# EAGLE design HF_Receiver (EAGLE 7.6.0)
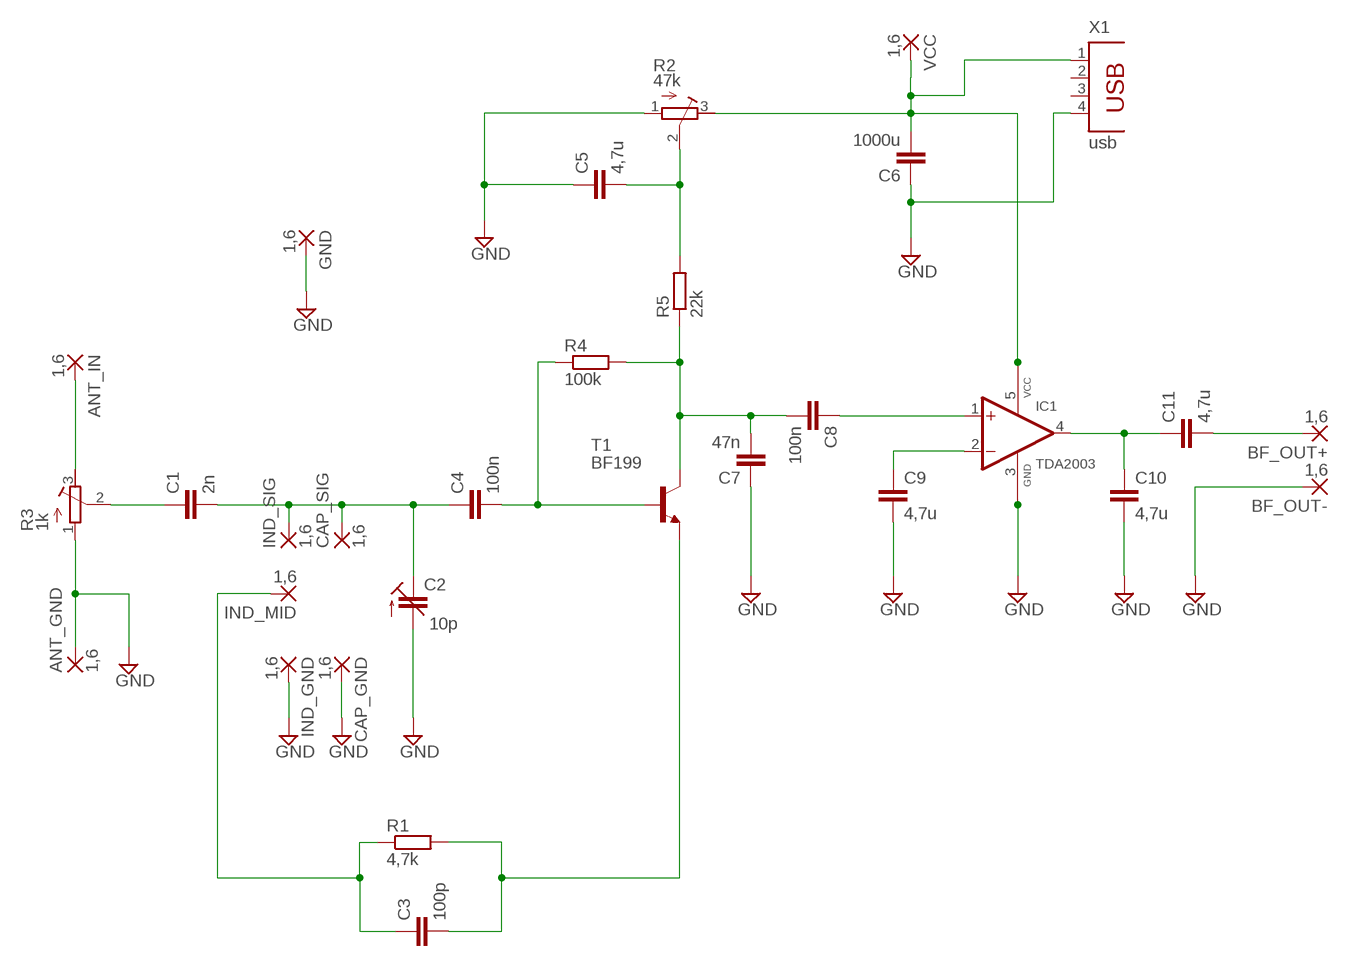
[diagram p0: schematic, sheet 1]

## Parts
ANT_GND  1,6  1,6/0,9  [1,6/0,9]
ANT_IN  1,6  1,6/0,9  [1,6/0,9]
BF_OUT+  1,6  1,6/0,9  [1,6/0,9]
BF_OUT-  1,6  1,6/0,9  [1,6/0,9]
C1  2n  C-EU075-032X103  [C075-032X103]
C2  10p  C-TRIMM808  [CTRIM808-BC]
C3  100p  C-EU075-032X103  [C075-032X103]
C4  100n  C-EU075-032X103  [C075-032X103]
C5  4,7u  C-EU075-032X103  [C075-032X103]
C6  1000u  C-EU075-032X103  [C075-032X103]
C7  47n  C-EU075-032X103  [C075-032X103]
C8  100n  C-EU075-032X103  [C075-032X103]
C9  4,7u  C-EU075-032X103  [C075-032X103]
C10  4,7u  C-EU075-032X103  [C075-032X103]
C11  4,7u  C-EU075-032X103  [C075-032X103]
CAP_GND  1,6  1,6/0,9  [1,6/0,9]
CAP_SIG  1,6  1,6/0,9  [1,6/0,9]
GND  1,6  1,6/0,9  [1,6/0,9]
IC1  TDA2003  [PENTAWATT-V]
IND_GND  1,6  1,6/0,9  [1,6/0,9]
IND_MID  1,6  1,6/0,9  [1,6/0,9]
IND_SIG  1,6  1,6/0,9  [1,6/0,9]
R1  4,7k  R-EU_0207/10  [0207/10]
R2  47k  R-TRIMM3339P  [RTRIM3339P]
R3  1k  R-TRIMM3339P  [RTRIM3339P]
R4  100k  R-EU_0207/10  [0207/10]
R5  22k  R-EU_0207/10  [0207/10]
T1  BF199  [TO92]
VCC  1,6  1,6/0,9  [1,6/0,9]
X1  usb  PN87520  [PN87520]

## Nets
GND: ANT_GND.1(P) BF_OUT-.1(P) C2.2(A) C5.1 C6.1 C7.1 C9.2 C10.2 CAP_GND.1(P) GND.1(P) IC1.3(GND) IND_GND.1(P) R2.1(A) R3.1(A) X1.4
N$1: ANT_IN.1(P) R3.3(E)
N$3: C1.1 R3.2(S)
N$4: C1.2 C2.1(E) C4.1 CAP_SIG.1(P) IND_SIG.1(P)
N$5: C3.1 IND_MID.1(P) R1.1
N$6: C3.2 R1.2 T1.2(E)
N$7: C4.2 R4.1 T1.1(B)
N$8: C8.1 IC1.1(+IN)
N$9: C7.2 C8.2 R4.2 R5.1 T1.3(C)
N$11: C5.2 R2.2(S) R5.2
N$12: C9.1 IC1.2(-IN)
N$13: C10.1 C11.1 IC1.4(OUT)
N$14: BF_OUT+.1(P) C11.2
VCC: C6.2 IC1.5(VCC) R2.3(E) VCC.1(P) X1.1
Unconnected: X1.2 X1.3

## Library data of the parts
ANT_GND ANT_IN BF_OUT+ BF_OUT- CAP_GND CAP_SIG GND IND_GND IND_MID IND_SIG VCC = wirepad:1,6/0,9: THROUGH-HOLE PAD
C1 C3-C11 = resistor:C-EU: CAPACITOR, European symbol
C2 = rcl:C-TRIMM: Trimm capacitor
IC1 = tda2003:TDA2003: Car Radio Audio Amplifier
R1 R4 R5 = resistor:R-EU_: RESISTOR, European symbol
R2 R3 = resistor:R-TRIMM: Trimm resistor
T1 = transistor:BF199: NPN TRANSISTOR
X1 = con-berg:PN87520: BERG USB connector; OC_FARNELL: unknown; OC_NEWARK: unknown

## Board
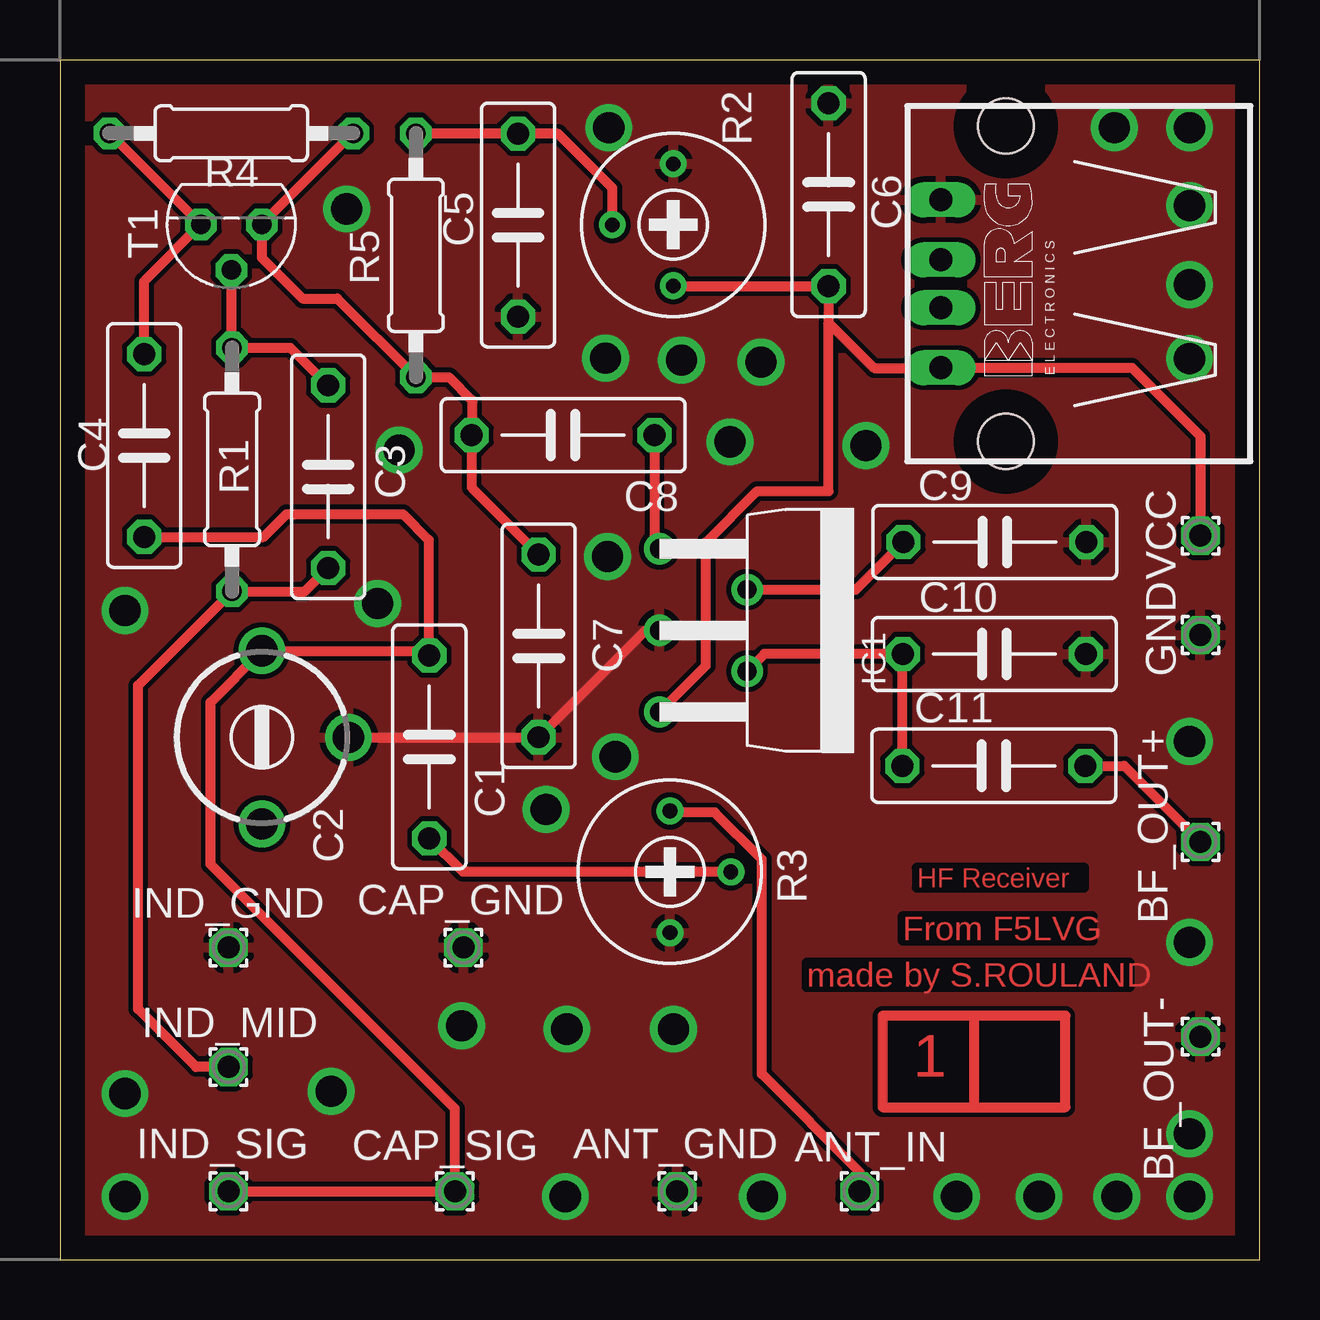
[diagram p1: board, top side]
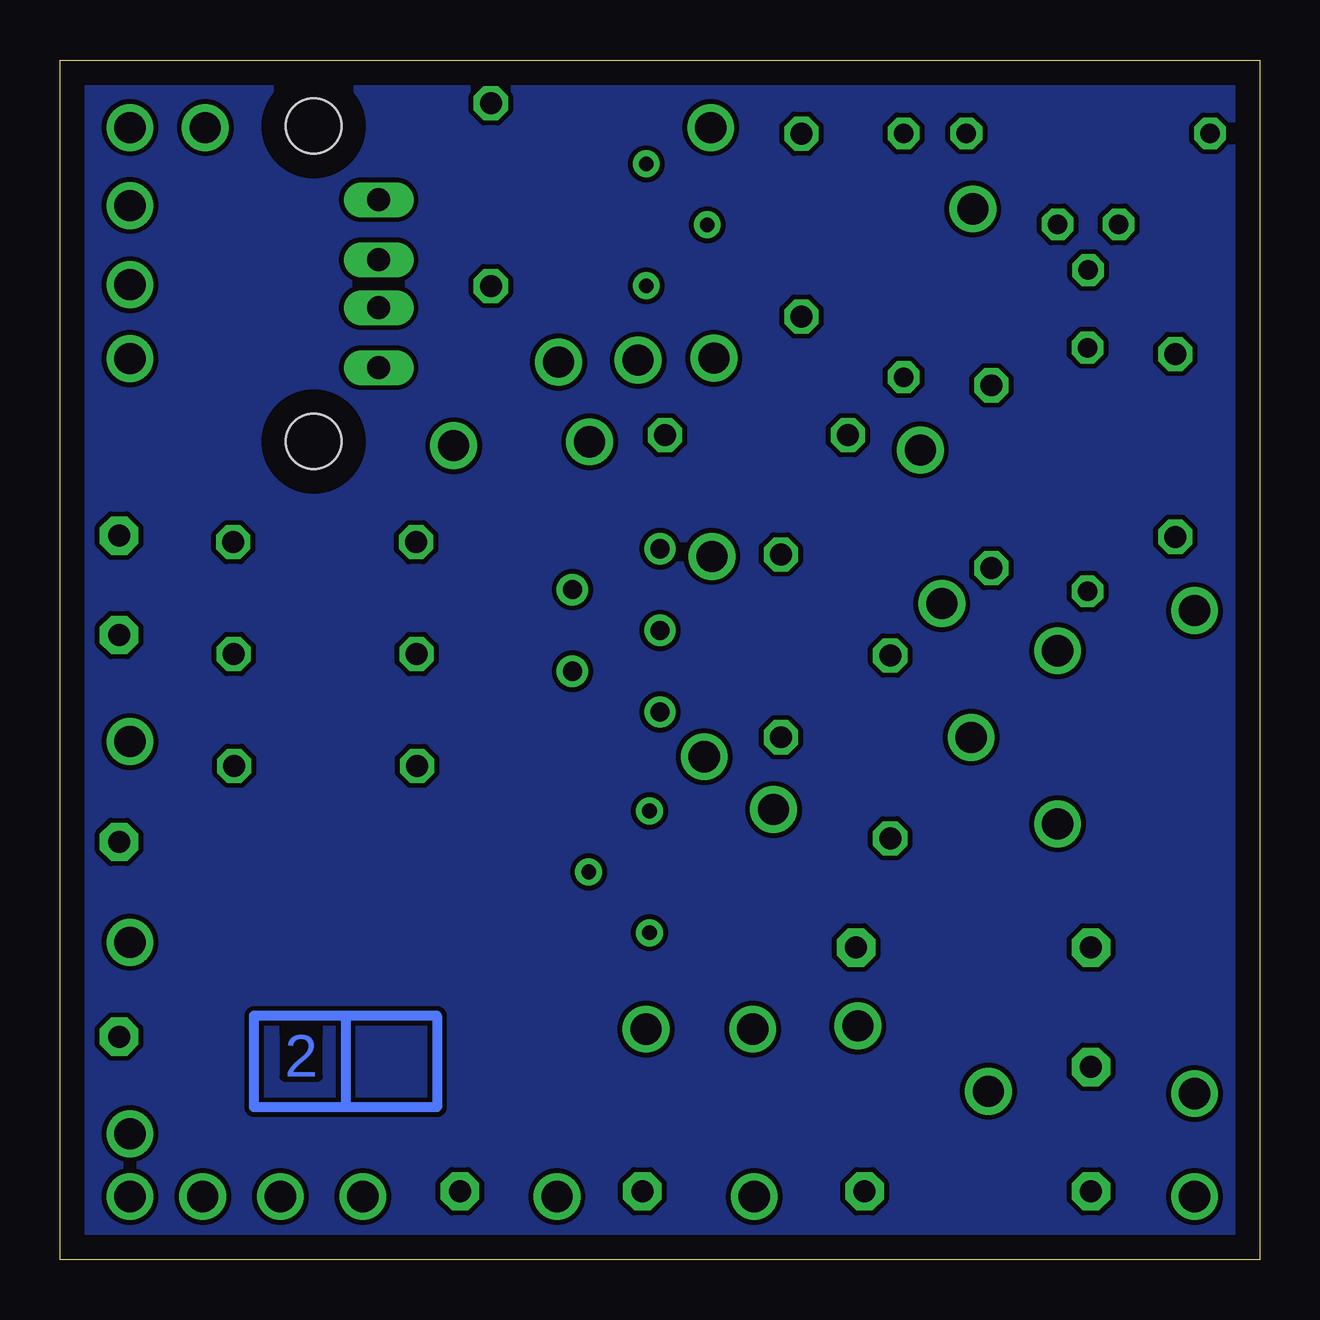
[diagram p2: board, bottom side, seen from below]

Size 50 x 50 mm. Coordinates in mm from the lower left corner, seen from the top.
Outline: 0,0 50,0 50,50 0,50 0,0
Copper layers (1*16): Top 0.035mm / dielectric 1.5mm / Bottom 0.035mm
Design rules "default *": minimum track width 10mil, minimum drill 24mil, track to track 8mil, track to pad 8mil, pad to pad 8mil, via to via 8mil, smd to smd 8mil, copper to edge 40mil, drill to drill 8mil, minimum pad ring 10mil, minimum via ring 8mil, stop-mask expansion 4mil, vias tented up to drill 0mil, thermal gap 10mil

### Footprints (pad centres in the part's own frame; a part is rotated, then mirrored left to right if it is on the bottom)
1,6/0,9 = drill 0.914 pad 1.6 octagon: 1 0,0
C075-032X103 = drill 0.914 octagon: 1 -3.81,0; 2 3.81,0
CTRIM808-BC = drill 1.3: 1 -3.607,0; 2 0,3.607; 3 3.607,0
PENTAWATT-V = drill 0.8: 1 -3.4,-3.81; 2 -1.7,-0.16; 3 0,-3.81; 4 1.7,-0.16; 5 3.4,-3.81
0207/10 = drill 0.813 octagon: 1 -5.08,0; 2 5.08,0
RTRIM3339P = drill 0.61: 1 -2.54,0; 2 0,-2.54; 3 2.54,0
TO92 = drill 0.813 octagon: 1 1.27,0; 2 0,1.905; 3 -1.27,0
PN87520 = drill 0.95 long: 1 -3.5,2.71; 2 -1,2.71; 3 1,2.71; 4 3.5,2.71 | hole 2.3: -6.57,0; 6.57,0

### Placement (x,y rotation side)
ANT_GND  25.72,2.84 180 top
ANT_IN  33.33,2.84 180 top
BF_OUT+  47.54,17.41 90 top
BF_OUT-  47.54,9.29 90 top
C1  15.39,21.37 90 top
C2  8.42,21.76 270 top
C3  11.18,32.63 90 top
C4  3.51,33.93 90 top
C5  19.09,43.12 90 top
C6  32.04,44.39 270 top
C7  19.95,25.58 90 top
C8  20.97,34.36 180 top
C9  38.96,29.9 0 top
C10  38.94,25.24 0 top
C11  38.92,20.58 0 top
CAP_GND  16.82,13.01 180 top
CAP_SIG  16.47,2.84 180 top
GND  47.54,26.03 90 top
IC1  28.8,26.22 270 top
IND_GND  7.02,13.01 180 top
IND_MID  7.02,8.03 180 top
IND_SIG  7.02,2.84 180 top
R1  7.17,32.93 90 top
R2  25.56,43.13 270 top
R3  25.43,16.16 90 top
R4  7.14,46.94 0 top
R5  14.83,41.86 90 top
T1  7.14,43.15 180 top
VCC  47.54,30.17 90 top
X1  39.43,40.67 90 top

### Tracks (layer width: path | path; a pad name or v marks a point on that pad's centre or on a via)
GND  (via drill 1.3)
  Top 0.406: IC1.3 24.41,26.22 C7.1 C2.2
  other vias: 25.57,9.6 21.12,9.6 16.74,9.74 11.3,7.01 2.71,6.92 2.71,27.05 13.24,27.34 20.25,18.76 29.29,2.62 21.06,2.62 2.71,2.62 37.38,2.62 40.81,2.62 47.08,2.62 44.05,2.62 47.08,5.24 47.08,13.22 47.08,21.59 47.08,40.63 47.08,43.93 47.08,47.18 47.08,37.55 43.95,47.18 33.59,33.92 23.15,20.96 22.83,29.3 22.75,37.57 25.9,37.49 29.22,37.41 27.92,34.08 22.88,47.18 11.95,43.79 14.14,33.74
  pour Top: 0,50 0,0 50,0 50,50
N$1
  Top 0.406: ANT_IN.1 33.33,3.65 29.25,7.73 29.25,16.68 27.29,18.64 25.48,18.64 R3.3
N$2
  Top 0.406: 38.1,6.35 34.29,6.35 34.29,10.16 38.1,10.16 | 38.1,6.35 41.91,6.35 41.91,10.16 38.1,10.16 | 38.1,10.16 38.1,6.35
N$3
  Top 0.406: R3.2 16.8,16.16 C1.1
N$4
  Top 0.406: C4.1 8.49,30.12 9.44,31.07 14.3,31.07 15.37,30 15.37,25.2 C1.2 15.2,25.37 C2.1 6.27,23.23 6.27,16.48 16.47,6.28 CAP_SIG.1 IND_SIG.1
N$5
  Top 0.406: C3.1 10.21,27.85 R1.1 3.26,23.94 3.26,10.44 5.67,8.03 IND_MID.1
N$6
  Top 0.406: T1.2 7.14,38.04 R1.2 9.6,38.01 C3.2
N$7
  Top 0.406: R4.1 2.06,46.96 T1.1 3.51,40.79 C4.2
N$8
  Top 0.406: C8.1 24.78,29.83 IC1.1
N$9
  Top 0.406: R4.2 12.22,46.96 T1.3 8.41,41.75 10.11,40.06 11.56,40.06 R5.1 16.21,36.78 17.18,35.81 17.18,34.37 C8.2 17.16,32.18 C7.2
N$10
  Bottom 0.406: 38.1,6.35 34.29,6.35 34.29,10.16 38.1,10.16 | 38.1,6.35 41.91,6.35 41.91,10.16 38.1,10.16 | 38.1,10.16 38.1,6.35
N$11
  Top 0.406: R2.2 23.02,44.67 20.77,46.92 C5.2 14.85,46.93 R5.2
N$12
  Top 0.406: IC1.2 33.17,27.92 C9.1
N$13
  Top 0.406: IC1.4 29.36,25.24 C10.1 35.11,25.22 C11.1
N$14
  Top 0.406: C11.2 44.36,20.58 BF_OUT+.1
N$15
  pour Bottom: 0,50 0,0 50,0 50,50
VCC
  Top 0.406: R2.3 25.58,40.58 C6.2 32.04,39.06 | 32.04,39.06 33.93,37.17 X1.1 44.68,37.17 47.54,34.32 VCC.1 | 32.04,39.06 32.04,32.02 29.05,32.02 26.92,29.89 26.92,24.75 IC1.5

### Text on the board
Top: HF Receiver | From F5LVG | made by S.ROULAND | 1
Bottom: 2